# Altium schematic sheet STM3205P_PowerSupply.SchDoc
size A3; Organization: Canis Tech; Address1: -; Address2: -; Address3: -; Address4: Indaiatuba/SP; DocumentNumber: 3; SheetNumber: 3; SheetTotal: 9; Address5: Brazil
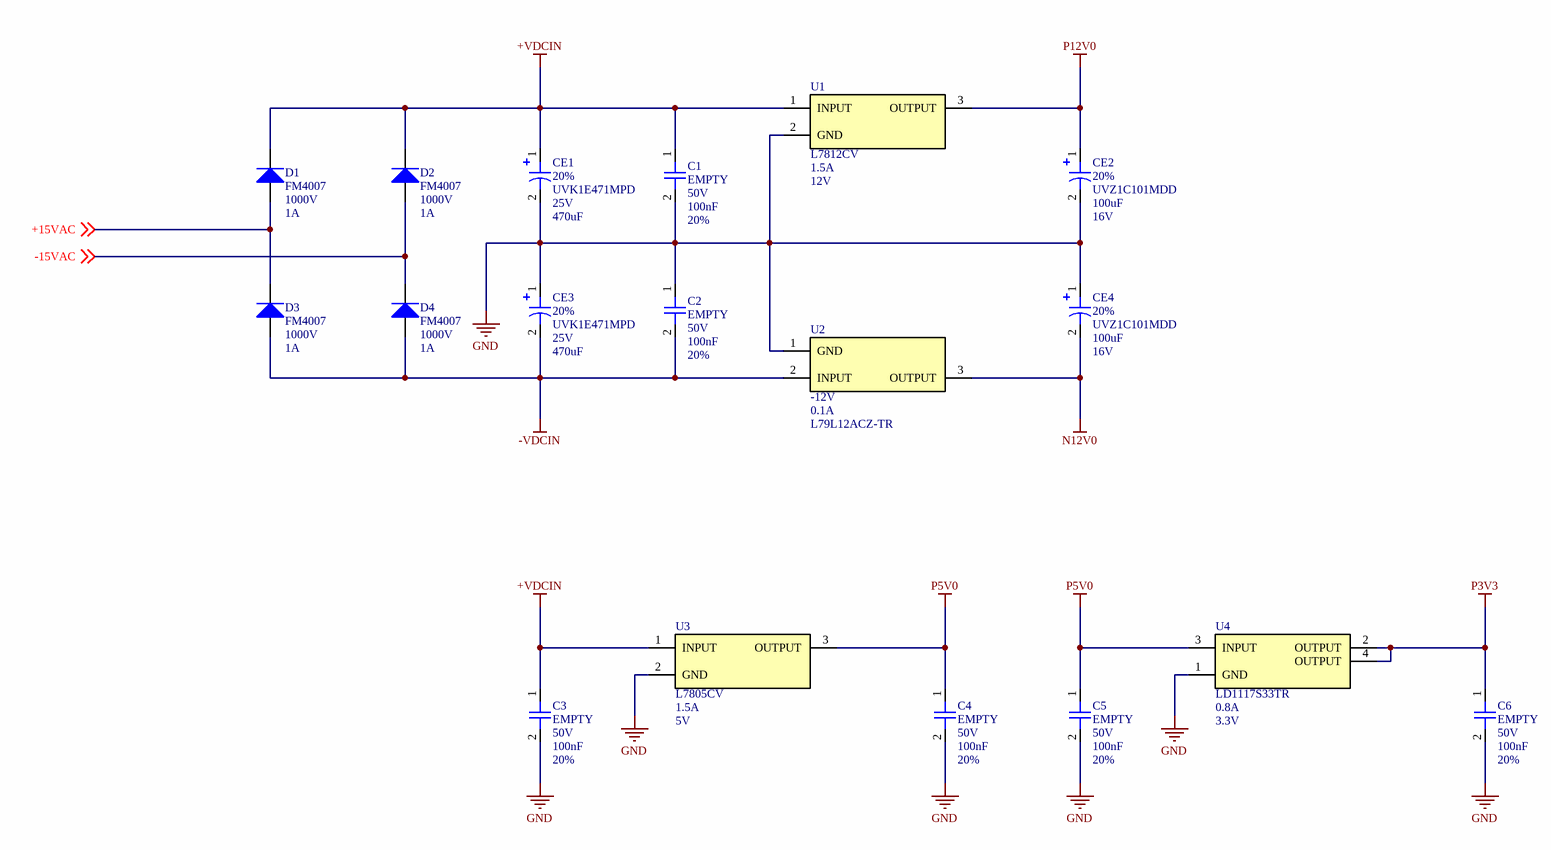
[diagram p0: STM3205P_PowerSupply.SchDoc]

## Parts
C1  value 100nF  PartNumber1: EMPTY  Voltage: 50V  Tolerance: 20%  [CAP0603]  (hidden comment: CC0603)
C2  value 100nF  PartNumber1: EMPTY  Voltage: 50V  Tolerance: 20%  [CAP0603]  (hidden comment: CC0603)
C3  value 100nF  PartNumber1: EMPTY  Voltage: 50V  Tolerance: 20%  [CAP0603]  (hidden comment: CC0603)
C4  value 100nF  PartNumber1: EMPTY  Voltage: 50V  Tolerance: 20%  [CAP0603]  (hidden comment: CC0603)
C5  value 100nF  PartNumber1: EMPTY  Voltage: 50V  Tolerance: 20%  [CAP0603]  (hidden comment: CC0603)
C6  value 100nF  PartNumber1: EMPTY  Voltage: 50V  Tolerance: 20%  [CAP0603]  (hidden comment: CC0603)
CE1  value 470uF  Tolerance: 20%  PartNumber1: UVK1E471MPD  Voltage: 25V  [5.0-10.0-12.5]  (hidden comment: 25V 470uF)
CE2  value 100uF  Tolerance: 20%  PartNumber1: UVZ1C101MDD  Voltage: 16V  [2.0-5.0-11.0]  (hidden comment: 16V 100uF)
CE3  value 470uF  Tolerance: 20%  PartNumber1: UVK1E471MPD  Voltage: 25V  [5.0-10.0-12.5]  (hidden comment: 25V 470uF)
CE4  value 100uF  Tolerance: 20%  PartNumber1: UVZ1C101MDD  Voltage: 16V  [2.0-5.0-11.0]  (hidden comment: 16V 100uF)
D1  Vrrm: 1000V  If: 1A  [DO-214AC]  (hidden comment: FM4007)
D2  Vrrm: 1000V  If: 1A  [DO-214AC]  (hidden comment: FM4007)
D3  Vrrm: 1000V  If: 1A  [DO-214AC]  (hidden comment: FM4007)
D4  Vrrm: 1000V  If: 1A  [DO-214AC]  (hidden comment: FM4007)
U1  Current: 1.5A  Voltage: 12V  [TO-220A]  (hidden comment: L7812CV)
U2  Voltage: -12V  Current: 0.1A  [TO-92A_2.5]  (hidden comment: L79L12ACZ-TR)
U3  Current: 1.5A  Voltage: 5V  [TO-220A]  (hidden comment: L7805CV)
U4  Current: 0.8A  Voltage: 3.3V  [SOT-223]  (hidden comment: LD1117S33TR)

## Nets
+VDCIN: C1.1 C3.1 CE1.1 D1.K D2.K U1.1(INPUT) U3.1(INPUT)
-VDCIN: C2.2 CE3.2 D3.A D4.A U2.2(INPUT)
GND: C1.2 C2.1 C3.2 C4.2 C5.2 C6.2 CE1.2 CE2.2 CE3.1 CE4.1 U1.2(GND) U2.1(GND) U3.2(GND) U4.1(GND)
N12V0: CE4.2 U2.3(OUTPUT)
P3V3: C6.1 U4.2(OUTPUT) U4.4(OUTPUT)
P5V0: C4.1 C5.1 U3.3(OUTPUT) U4.3(INPUT)
P12V0: CE2.1 U1.3(OUTPUT)
+15VAC: D1.A D3.K ; off-sheet +15VAC
-15VAC: D2.A D4.K ; off-sheet -15VAC

## Notes on the sheet
- Title
- Author
- Checked By
- Variant
- Size:
- Revision:
- A3
- Date:
- Project
- Time:
- Sheet
- of
- File:

## Library data of the parts
C1-C6 = CC0603: Surface Mount Multilayer Ceramic Chip Capacitors  for Commercial Applications; Manufacturer1: Yageo; Published: 19-Jun-2016; LatestRevisionDate: 19-Jun-2016; Publisher: Lucas Moraes; PackageReference: CAP0603; PackageDescription: CAP0603;2 Leads
CE1 CE3 = 25V 470uF: Electrolytic Capacitor PTH; Manufacturer1: Nichicon; Code: 471; Published: 24-Aug-2025; LatestRevisionDate: 24-Aug-2025; Publisher: Lucas Moraes; LatestRevisionNote: Created; PackageReference: 5.0-10.0-12.5; PackageDescription: 5.0-10.0-12.5;2 Leads
CE2 CE4 = 16V 100uF: Electrolytic Capacitor PTH; Manufacturer1: Nichicon; Code: 101; Published: 26-Dec-2016; LatestRevisionDate: 26-Dec-2016; PackageReference: 2-5; Publisher: Lucas Moraes; PackageDescription: 2-5;2 leads; LatestRevisionNote: Created
D1-D4 = FM4007: General Purpose Plastic Rectifier; Manufacturer1: Rectron; Vf: 1.1V; Published: 25-Feb-2019; LatestRevisionDate: 25-Feb-2019; PackageReference: DO-214AC; Publisher: Lucas Moraes; PackageDescription: DO-214AC; 2 Leads; PartNumber1: FM4007
U1 = L7812CV: Positive voltage regulator ICs; Manufacturer1: STMicroelectronics; Published: 29-May-2016; LatestRevisionDate: 25-Jun-2023; LatestRevisionNote: Created; PackageReference: TO220A; Publisher: Lucas Moraes; PackageDescription: TO220A;3 Leads; PartNumber1: L7812CV
U2 = L79L12ACZ-TR: Negative voltage regulator ICs; Manufacturer1: STMicroelectronics; Published: 17-Aug-2025; LatestRevisionDate: 17-Aug-2025; LatestRevisionNote: Created; PackageReference: TO-92; Publisher: Lucas Moraes; PackageDescription: TO-92;3 Leads; PartNumber1: L79L12ACZ-TR
U3 = L7805CV: Positive voltage regulator ICs; Manufacturer1: STMicroelectronics; Published: 29-May-2016; LatestRevisionDate: 25-Jun-2023; LatestRevisionNote: Created; PackageReference: TO220A; Publisher: Lucas Moraes; PackageDescription: TO220A;3 Leads; PartNumber1: L7805CV
U4 = LD1117S33TR: Positive voltage regulator ICs; Manufacturer1: STMicroelectronics; Published: 20-Sep-2019; LatestRevisionDate: 20-Sep-2019; LatestRevisionNote: Created; PackageReference: SOT-223; Publisher: Lucas Moraes; PackageDescription: SOT-223;3 Leads; PartNumber1: LD1117S33TR